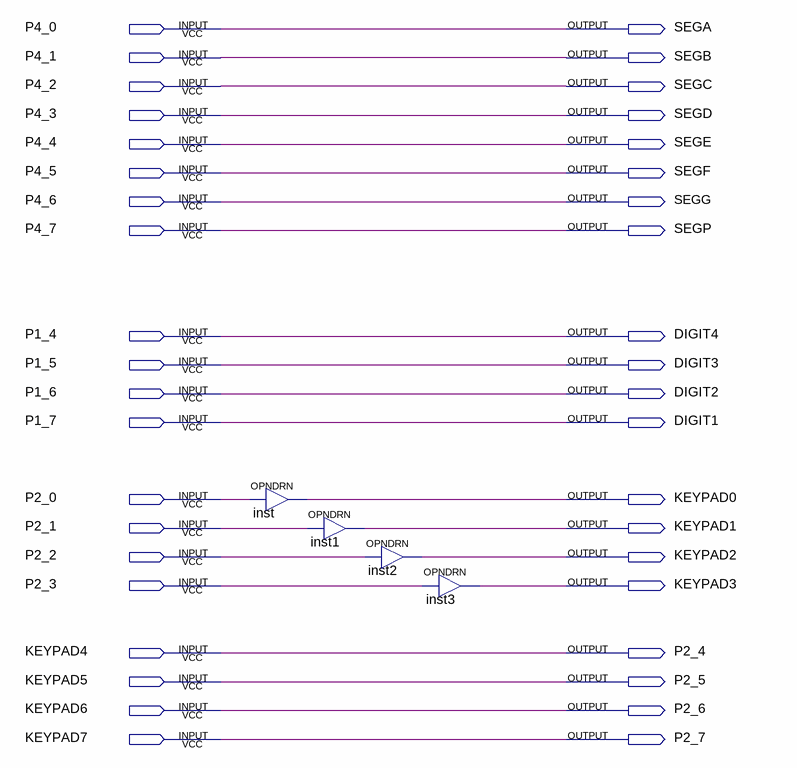
[diagram p0: schematic sheet]
// Quartus schematic ece315_top.bdf as structural Verilog: 4 symbols, 40 pins
module ece315_top (
  input  P4_0,
  input  P4_1,
  input  P4_2,
  input  P4_3,
  input  P4_4,
  input  P4_5,
  input  P4_6,
  input  P4_7,
  input  P1_4,
  input  P1_5,
  input  P1_6,
  input  P1_7,
  input  P2_0,
  input  P2_1,
  input  P2_2,
  input  P2_3,
  input  KEYPAD4,
  input  KEYPAD5,
  input  KEYPAD6,
  input  KEYPAD7,
  output SEGA,
  output SEGB,
  output SEGC,
  output SEGD,
  output SEGE,
  output SEGF,
  output SEGG,
  output SEGP,
  output DIGIT4,
  output DIGIT3,
  output DIGIT2,
  output DIGIT1,
  output KEYPAD0,
  output KEYPAD1,
  output KEYPAD2,
  output KEYPAD3,
  output P2_4,
  output P2_5,
  output P2_6,
  output P2_7
);

  OPNDRN inst (.IN(P2_0), .OUT(KEYPAD0));
  OPNDRN inst1 (.IN(P2_1), .OUT(KEYPAD1));
  OPNDRN inst2 (.IN(P2_2), .OUT(KEYPAD2));
  OPNDRN inst3 (.IN(P2_3), .OUT(KEYPAD3));

  assign DIGIT1 = P1_7;
  assign DIGIT2 = P1_6;
  assign DIGIT3 = P1_5;
  assign DIGIT4 = P1_4;
  assign P2_4 = KEYPAD4;
  assign P2_5 = KEYPAD5;
  assign P2_6 = KEYPAD6;
  assign P2_7 = KEYPAD7;
  assign SEGA = P4_0;
  assign SEGB = P4_1;
  assign SEGC = P4_2;
  assign SEGD = P4_3;
  assign SEGE = P4_4;
  assign SEGF = P4_5;
  assign SEGG = P4_6;
  assign SEGP = P4_7;
endmodule
